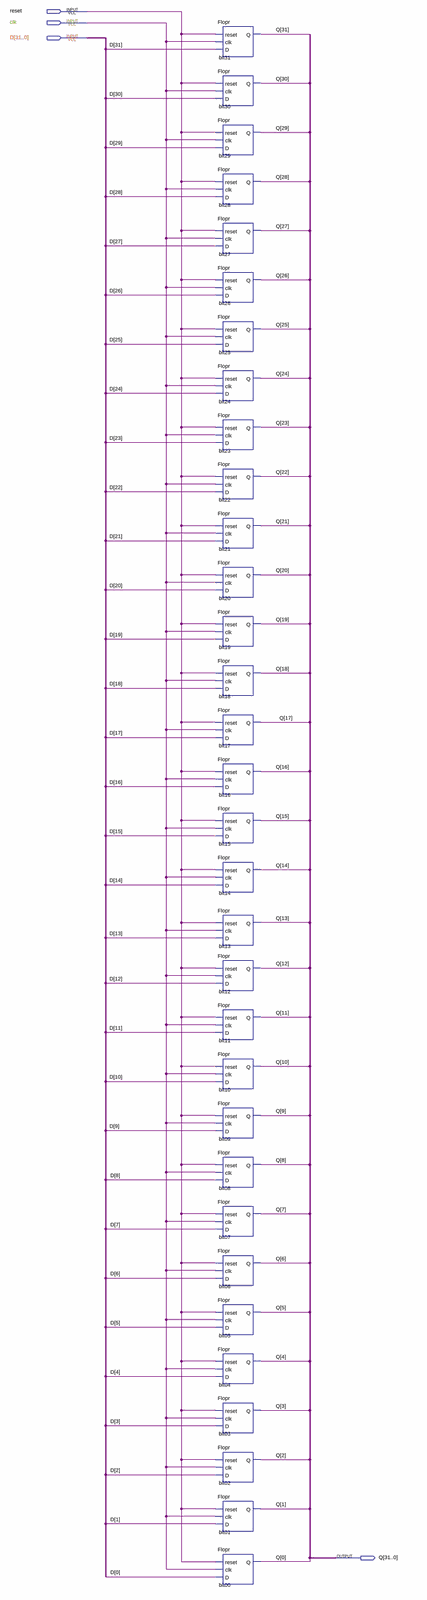
[diagram p0: schematic sheet, whole]
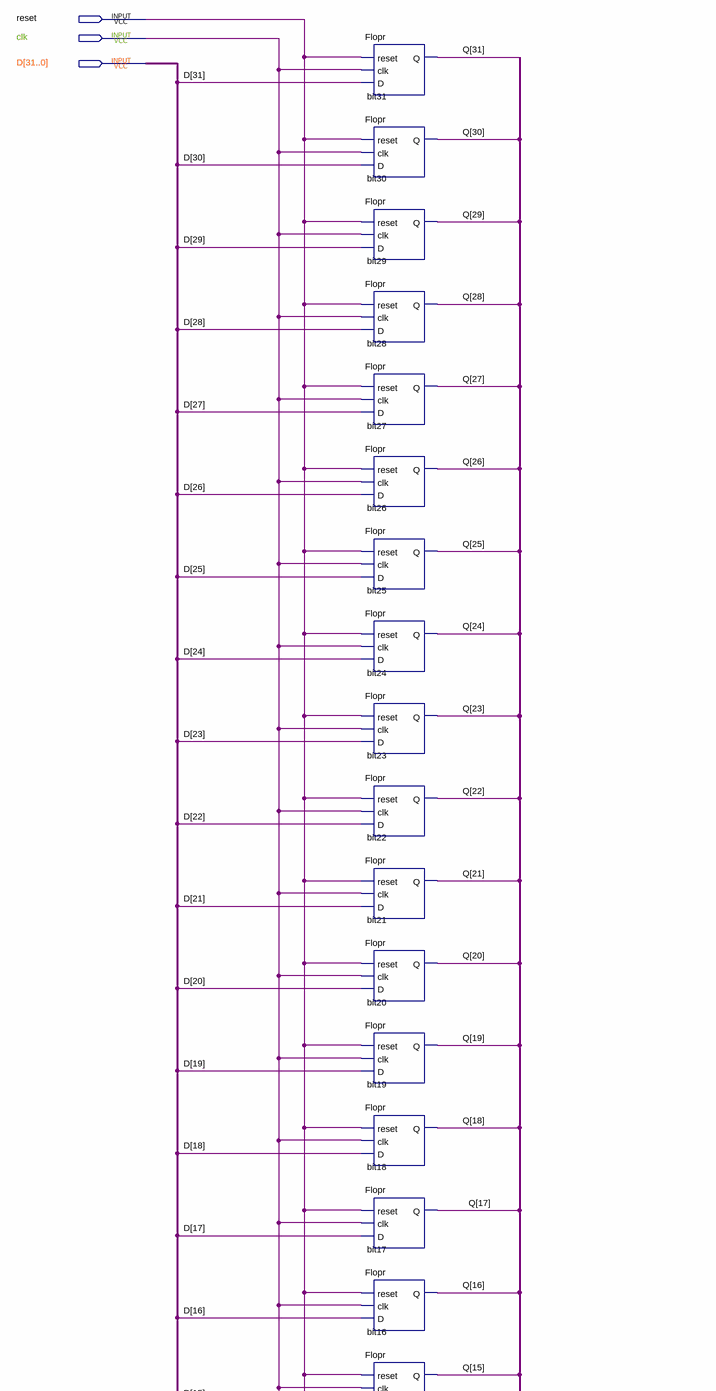
[diagram p1: schematic sheet, upper part]
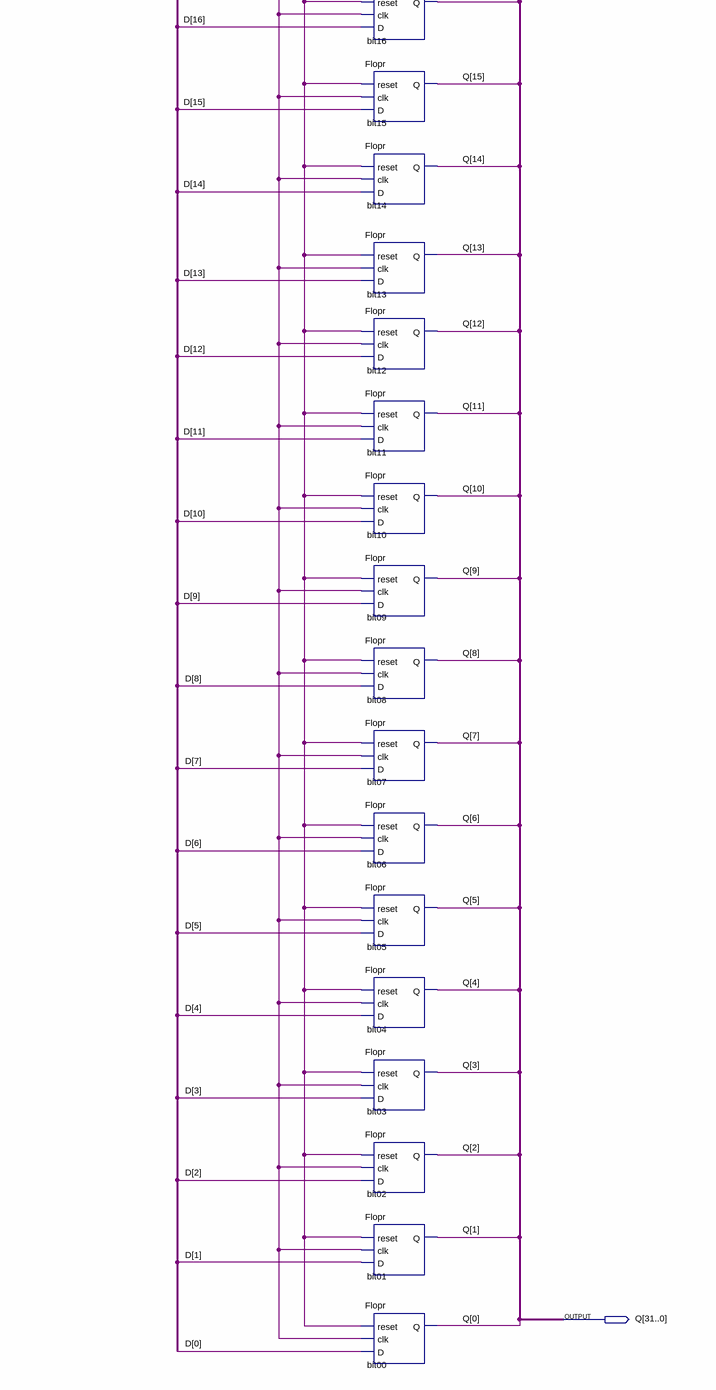
[diagram p2: schematic sheet, lower part]
// Quartus schematic Flopr_32.bdf as structural Verilog: 32 symbols, 4 pins
module Flopr_32 (
  input  reset,
  input  clk,
  input  [31:0] D,
  output [31:0] Q
);

  Flopr bit31 (.reset(reset), .clk(clk), .D(D[31]), .Q(Q[31]));
  Flopr bit30 (.reset(reset), .clk(clk), .D(D[30]), .Q(Q[30]));
  Flopr bit29 (.reset(reset), .clk(clk), .D(D[29]), .Q(Q[29]));
  Flopr bit28 (.reset(reset), .clk(clk), .D(D[28]), .Q(Q[28]));
  Flopr bit27 (.reset(reset), .clk(clk), .D(D[27]), .Q(Q[27]));
  Flopr bit26 (.reset(reset), .clk(clk), .D(D[26]), .Q(Q[26]));
  Flopr bit25 (.reset(reset), .clk(clk), .D(D[25]), .Q(Q[25]));
  Flopr bit24 (.reset(reset), .clk(clk), .D(D[24]), .Q(Q[24]));
  Flopr bit23 (.reset(reset), .clk(clk), .D(D[23]), .Q(Q[23]));
  Flopr bit22 (.reset(reset), .clk(clk), .D(D[22]), .Q(Q[22]));
  Flopr bit21 (.reset(reset), .clk(clk), .D(D[21]), .Q(Q[21]));
  Flopr bit20 (.reset(reset), .clk(clk), .D(D[20]), .Q(Q[20]));
  Flopr bit19 (.reset(reset), .clk(clk), .D(D[19]), .Q(Q[19]));
  Flopr bit18 (.reset(reset), .clk(clk), .D(D[18]), .Q(Q[18]));
  Flopr bit17 (.reset(reset), .clk(clk), .D(D[17]), .Q(Q[17]));
  Flopr bit16 (.reset(reset), .clk(clk), .D(D[16]), .Q(Q[16]));
  Flopr bit15 (.reset(reset), .clk(clk), .D(D[15]), .Q(Q[15]));
  Flopr bit14 (.reset(reset), .clk(clk), .D(D[14]), .Q(Q[14]));
  Flopr bit13 (.reset(reset), .clk(clk), .D(D[13]), .Q(Q[13]));
  Flopr bit12 (.reset(reset), .clk(clk), .D(D[12]), .Q(Q[12]));
  Flopr bit11 (.reset(reset), .clk(clk), .D(D[11]), .Q(Q[11]));
  Flopr bit10 (.reset(reset), .clk(clk), .D(D[10]), .Q(Q[10]));
  Flopr bit09 (.reset(reset), .clk(clk), .D(D[9]), .Q(Q[9]));
  Flopr bit08 (.reset(reset), .clk(clk), .D(D[8]), .Q(Q[8]));
  Flopr bit07 (.reset(reset), .clk(clk), .D(D[7]), .Q(Q[7]));
  Flopr bit06 (.reset(reset), .clk(clk), .D(D[6]), .Q(Q[6]));
  Flopr bit05 (.reset(reset), .clk(clk), .D(D[5]), .Q(Q[5]));
  Flopr bit04 (.reset(reset), .clk(clk), .D(D[4]), .Q(Q[4]));
  Flopr bit03 (.reset(reset), .clk(clk), .D(D[3]), .Q(Q[3]));
  Flopr bit02 (.reset(reset), .clk(clk), .D(D[2]), .Q(Q[2]));
  Flopr bit01 (.reset(reset), .clk(clk), .D(D[1]), .Q(Q[1]));
  Flopr bit00 (.reset(reset), .clk(clk), .D(D[0]), .Q(Q[0]));
endmodule
